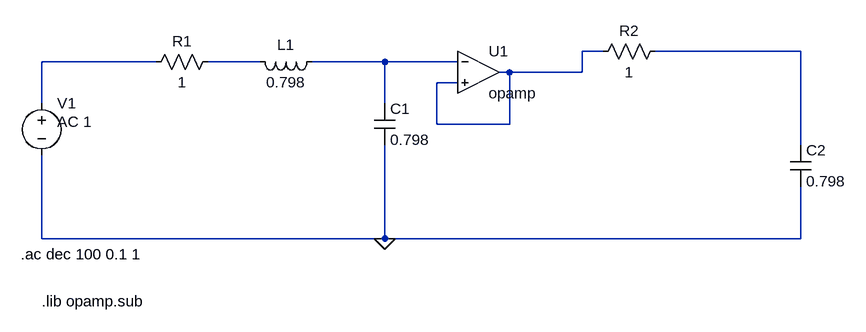
[diagram p0: schematic Draft1.asc]
Draft1.asc, the LTspice schematic file:
Version 4
SHEET 1 1040 680
WIRE 656 64 624 64
WIRE 960 64 736 64
WIRE -32 80 -208 80
WIRE 128 80 48 80
WIRE 320 80 208 80
WIRE 432 80 320 80
WIRE 512 96 496 96
WIRE 624 96 624 64
WIRE 624 96 512 96
WIRE 432 112 400 112
WIRE -208 144 -208 80
WIRE 320 144 320 80
WIRE 400 176 400 112
WIRE 512 176 512 96
WIRE 512 176 400 176
WIRE 960 208 960 64
WIRE -208 352 -208 224
WIRE 320 352 320 208
WIRE 320 352 -208 352
WIRE 960 352 960 272
WIRE 960 352 320 352
FLAG 320 352 0
SYMBOL res 64 64 R90
WINDOW 0 0 56 VBottom 2
WINDOW 3 32 56 VTop 2
SYMATTR InstName R1
SYMATTR Value 1
SYMBOL res 752 48 R90
WINDOW 0 0 56 VBottom 2
WINDOW 3 32 56 VTop 2
SYMATTR InstName R2
SYMATTR Value 1
SYMBOL ind 224 64 R90
WINDOW 0 5 56 VBottom 2
WINDOW 3 32 56 VTop 2
SYMATTR InstName L1
SYMATTR Value 0.798
SYMBOL cap 304 144 R0
SYMATTR InstName C1
SYMATTR Value 0.798
SYMBOL voltage -208 128 R0
WINDOW 123 24 44 Left 2
WINDOW 39 0 0 Left 2
SYMATTR Value2 AC 1
SYMATTR InstName V1
SYMATTR Value ""
SYMBOL Opamps\\opamp 464 32 R0
SYMATTR InstName U1
SYMBOL cap 944 208 R0
SYMATTR InstName C2
SYMATTR Value 0.798
TEXT -240 376 Left 2 !.ac dec 100 0.1 1
TEXT -208 448 Left 2 !.lib opamp.sub

The netlist it stands for:
* Draft1.asc
R1 N004 N003 1
R2 N002 N001 1
L1 N005 N004 0.798
C1 N005 0 0.798
V1 N003 0 AC 1
XU1 N005 N001 N001 opamp Aol=100K GBW=10Meg  ; pins invin noninvin out
C2 N002 0 0.798
.ac dec 100 0.1 1
.lib opamp.sub
.backanno
.end